# Altium schematic sheet Esp32.SchDoc: Esp32
size A4; DrawnBy: Erwan/Pierre/Guillaume/Adam; Revision: V0.1 Rev A; SheetNumber: 2; SheetTotal: 9
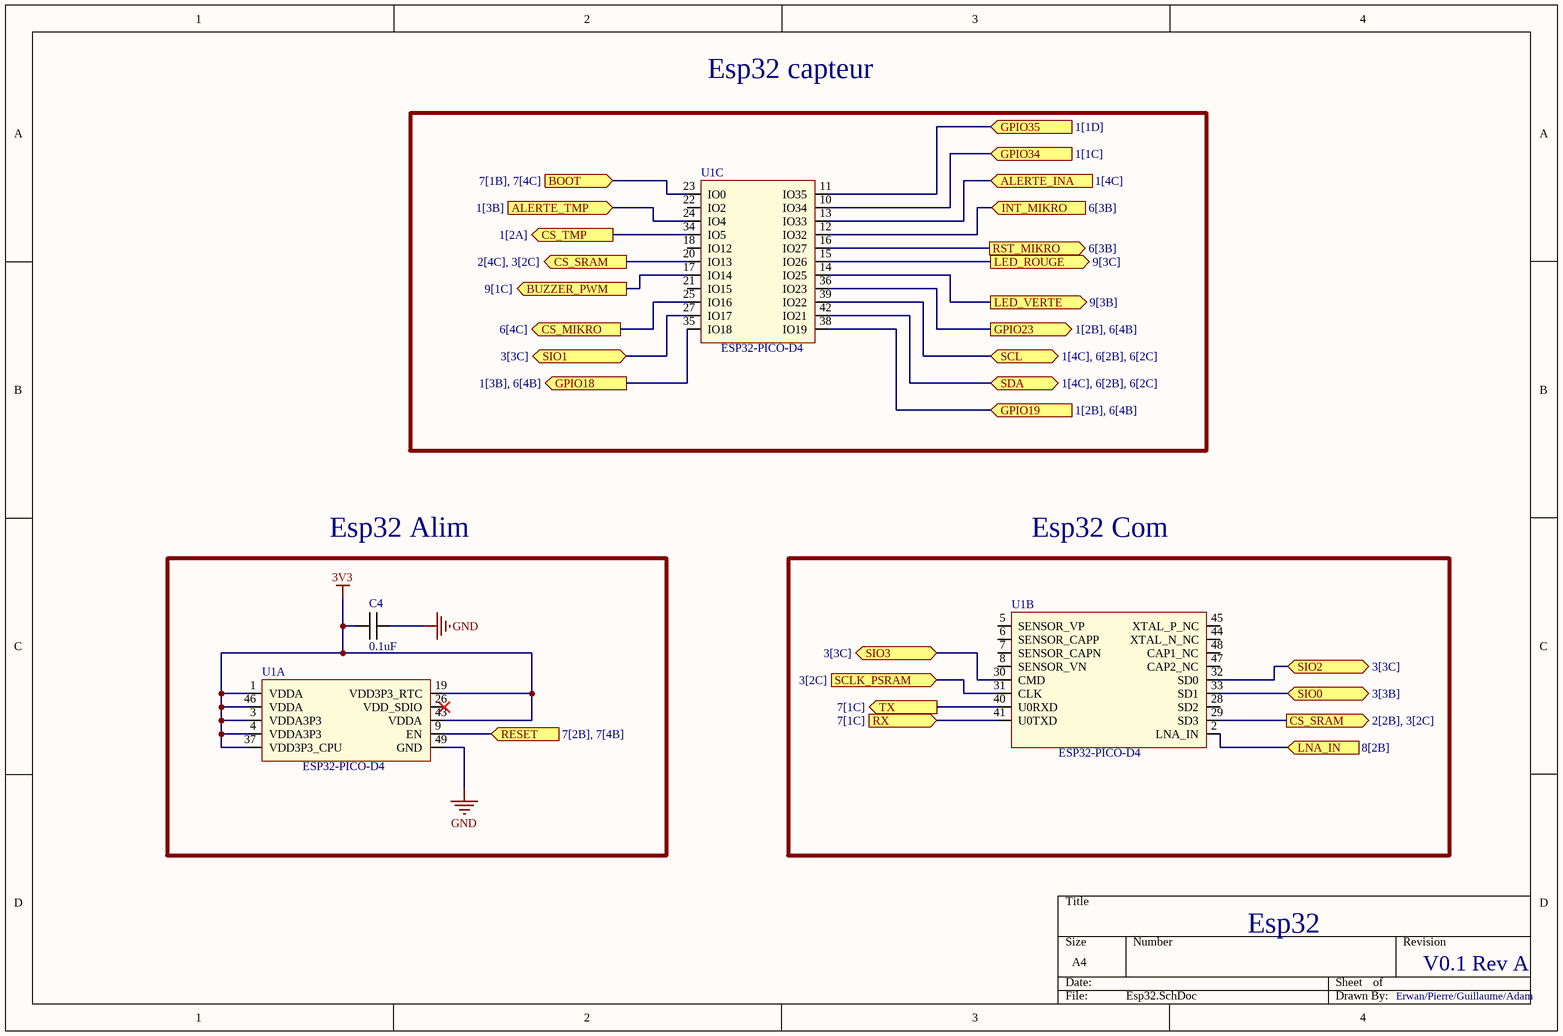
[diagram p0: Esp32.SchDoc]

## Parts
C4  0.1uF  [CAPC1005X06N]
U1  ESP32-PICO-D4  [PQFN50P700X700X104_HS-49N]  (parts A,B,C of 3)

## Blocks framed on the sheet
Esp32 Alim: C4 U1
Esp32 Com: U1

## Ports
ALERTE_INA (in, see 1[4C]), ALERTE_TMP (in, see 1[3B]), BOOT (in, see 7[1B], 7[4C]), BUZZER_PWM (out, see 9[1C]), CS_MIKRO (out, see 6[4C]), CS_SRAM (out, see 2[2B], 3[2C]), CS_SRAM (out, see 2[4C], 3[2C]), CS_TMP (out, see 1[2A]), GPIO18 (out, see 1[3B], 6[4B]), GPIO19 (in, see 1[2B], 6[4B]), GPIO23 (out, see 1[2B], 6[4B]), GPIO34 (in, see 1[1C]), GPIO35 (in, see 1[1D]), INT_MIKRO (in, see 6[3B]), LED_ROUGE (out, see 9[3C]), LED_VERTE (out, see 9[3B]), LNA_IN (in, see 8[2B]), RESET (in, see 7[2B], 7[4B]), RST_MIKRO (out, see 6[3B]), RX (in, see 7[1C]), SCL (bidir, see 1[4C], 6[2B], 6[2C]), SCLK_PSRAM (in, see 3[2C]), SDA (bidir, see 1[4C], 6[2B], 6[2C]), SIO0 (bidir, see 3[3B]), SIO1 (bidir, see 3[3C]), SIO2 (bidir, see 3[3C]), SIO3 (bidir, see 3[3C]), TX (out, see 7[1C])

## Nets
3V3: C4.1 U1.1(VDDA) U1.3(VDDA3P3) U1.4(VDDA3P3) U1.19(VDD3P3_RTC) U1.37(VDD3P3_CPU) U1.43(VDDA) U1.46(VDDA)
GND: C4.2 U1.49(GND)
ALERTE_INA: U1.13(IO33) ; port ALERTE_INA
ALERTE_TMP: U1.24(IO4) ; port ALERTE_TMP
BOOT: U1.23(IO0) ; port BOOT
BUZZER_PWM: U1.17(IO14) ; port BUZZER_PWM
CS_MIKRO: U1.25(IO16) ; port CS_MIKRO
CS_SRAM: U1.20(IO13) U1.29(SD3) ; port CS_SRAM
CS_TMP: U1.34(IO5) ; port CS_TMP
GPIO18: U1.35(IO18) ; port GPIO18
GPIO19: U1.38(IO19) ; port GPIO19
GPIO23: U1.36(IO23) ; port GPIO23
GPIO34: U1.10(IO34) ; port GPIO34
GPIO35: U1.11(IO35) ; port GPIO35
INT_MIKRO: U1.12(IO32) ; port INT_MIKRO
LED_ROUGE: U1.15(IO26) ; port LED_ROUGE
LED_VERTE: U1.14(IO25) ; port LED_VERTE
LNA_IN: U1.2(LNA_IN) ; port LNA_IN
RESET: U1.9(EN) ; port RESET
RST_MIKRO: U1.16(IO27) ; port RST_MIKRO
RX: U1.41(U0TXD) ; port RX
SCL: U1.39(IO22) ; port SCL
SCLK_PSRAM: U1.31(CLK) ; port SCLK_PSRAM
SDA: U1.42(IO21) ; port SDA
SIO0: U1.33(SD1) ; port SIO0
SIO1: U1.27(IO17) ; port SIO1
SIO2: U1.32(SD0) ; port SIO2
SIO3: U1.30(CMD) ; port SIO3
TX: U1.40(U0RXD) ; port TX

Not connected (* = marked no-connect by the designer): U1 5(SENSOR_VP) 6(SENSOR_CAPP) 7(SENSOR_CAPN) 8(SENSOR_VN) 18(IO12) 21(IO15) 22(IO2) 26(VDD_SDIO)* 28(SD2) 44(XTAL_N_NC) 45(XTAL_P_NC) 47(CAP2_NC) 48(CAP1_NC)

## Notes on the sheet
- Esp32 capteur

## Library data of the parts
C4 = Capacitor
U1 = ESP32: Système RF sur puce - SoC SIP module ESP32 with 4MByte Flash, Dual Core MCU, Wi-Fi & Bluetooth Combo, LGA48-pin, 7*7mm; Manufacturer 1: Espressif Systems; Supplier 1: Digi-Key; Supplier Part Number 1: 1904-1029-1-ND; Manufacturer Part Number 1: ESP32-PICO-D4